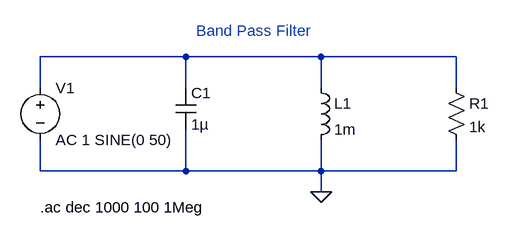
[diagram p0: schematic 3EEC_VELASCO_EXPT7_CKT5.asc]
3EEC_VELASCO_EXPT7_CKT5.asc, the LTspice schematic file:
Version 4
SHEET 1 880 680
WIRE 240 96 16 96
WIRE 448 96 240 96
WIRE 656 96 448 96
WIRE 16 144 16 96
WIRE 240 144 240 96
WIRE 448 144 448 96
WIRE 656 144 656 96
WIRE 16 272 16 224
WIRE 240 272 240 208
WIRE 240 272 16 272
WIRE 448 272 448 224
WIRE 448 272 240 272
WIRE 656 272 656 224
WIRE 656 272 448 272
WIRE 448 304 448 272
FLAG 448 304 0
SYMBOL voltage 16 128 R0
SYMATTR InstName V1
SYMATTR Value AC 1 SINE(0 50)
SYMBOL res 640 128 R0
SYMATTR InstName R1
SYMATTR Value 1k
SYMBOL ind 432 128 R0
SYMATTR InstName L1
SYMATTR Value 1m
SYMBOL cap 224 144 R0
SYMATTR InstName C1
SYMATTR Value 1µ
TEXT 16 328 Left 2 !.ac dec 1000 100 1Meg
TEXT 256 56 Left 2 ;Band Pass Filter

The netlist it stands for:
* 3EEC_VELASCO_EXPT7_CKT5.asc
V1 N001 0 AC 1 SINE(0 50)
R1 N001 0 1k
L1 N001 0 1m
C1 N001 0 1µ
.ac dec 1000 100 1Meg
* Band Pass Filter
.backanno
.end